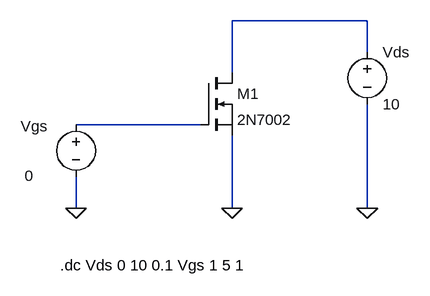
[diagram p0: schematic Question 2.asc]
Question 2.asc, the LTspice schematic file:
Version 4.1
SHEET 1 880 680
WIRE 448 -32 240 -32
WIRE 448 16 448 -32
WIRE 240 48 240 -32
WIRE 192 128 0 128
WIRE 0 256 0 208
WIRE 240 256 240 144
WIRE 448 256 448 96
FLAG 0 256 0
FLAG 240 256 0
FLAG 448 256 0
SYMBOL voltage 0 112 R0
WINDOW 0 -85 18 Left 2
WINDOW 3 -79 94 Left 2
SYMATTR InstName Vgs
SYMATTR Value 0
SYMBOL nmos 192 48 R0
SYMATTR InstName M1
SYMATTR Value 2N7002
SYMBOL voltage 448 0 R0
SYMATTR InstName Vds
SYMATTR Value 10
TEXT -24 344 Left 2 !.dc Vds 0 10 0.1 Vgs 1 5 1

The netlist it stands for:
* Question 2.asc
Vgs N002 0 0
M1 N001 N002 0 0 2N7002
Vds N001 0 10
.model NMOS NMOS
.model PMOS PMOS
.lib standard.mos
.dc Vds 0 10 0.1 Vgs 1 5 1
.backanno
.end